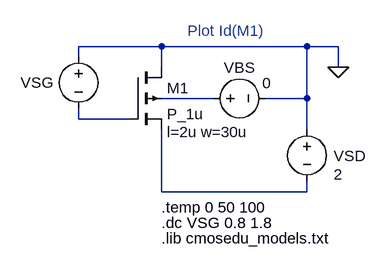
[diagram p0: schematic Fig9_29_PMOS.asc]
Fig9_29_PMOS.asc, the LTspice schematic file:
Version 4
SHEET 1 1184 688
WIRE 320 96 320 80
WIRE 320 192 320 176
WIRE 400 192 320 192
WIRE 448 80 320 80
WIRE 448 112 448 80
WIRE 448 304 448 208
WIRE 528 160 448 160
WIRE 672 80 448 80
WIRE 672 160 608 160
WIRE 672 160 672 80
WIRE 672 208 672 160
WIRE 672 304 448 304
WIRE 672 304 672 288
WIRE 720 80 672 80
WIRE 720 112 720 80
FLAG 720 112 0
SYMBOL voltage 320 80 R0
WINDOW 0 -89 56 Left 0
WINDOW 3 24 104 Invisible 0
SYMATTR InstName VSG
SYMATTR Value 0
SYMBOL voltage 672 192 R0
WINDOW 123 0 0 Left 0
WINDOW 39 0 0 Left 0
WINDOW 0 41 57 Left 0
WINDOW 3 41 85 Left 0
SYMATTR InstName VSD
SYMATTR Value 2
SYMBOL voltage 512 160 M90
WINDOW 0 -32 56 VBottom 0
WINDOW 3 -8 98 VBottom 0
WINDOW 123 0 0 Left 0
WINDOW 39 0 0 Left 0
SYMATTR InstName VBS
SYMATTR Value 0
SYMBOL pmos4 400 112 R0
WINDOW 123 56 100 Left 0
SYMATTR Value2 l=2u w=30u
SYMATTR InstName M1
SYMATTR Value P_1u
TEXT 448 352 Left 0 !.dc VSG 0.8 1.8
TEXT 448 376 Left 0 !.lib cmosedu_models.txt
TEXT 488 56 Left 0 ;Plot Id(M1)
TEXT 448 328 Left 0 !.temp 0 50 100

The netlist it stands for:
* Fig9_29_PMOS.asc
VSG 0 N001 0
VSD 0 N002 2
VBS N003 0 0
M1 0 N001 N002 N003 P_1u l=2u w=30u
.model NMOS NMOS
.model PMOS PMOS
.lib standard.mos
.dc VSG 0.8 1.8
.lib cmosedu_models.txt
* Plot Id(M1)
.temp 0 50 100
.backanno
.end